# EasyEDA schematic scheme.json
TITLE: 220Vac 3-INPUT OR GATE; REV: A; Sheet: 1/1; Drawn By: Perovic Milo
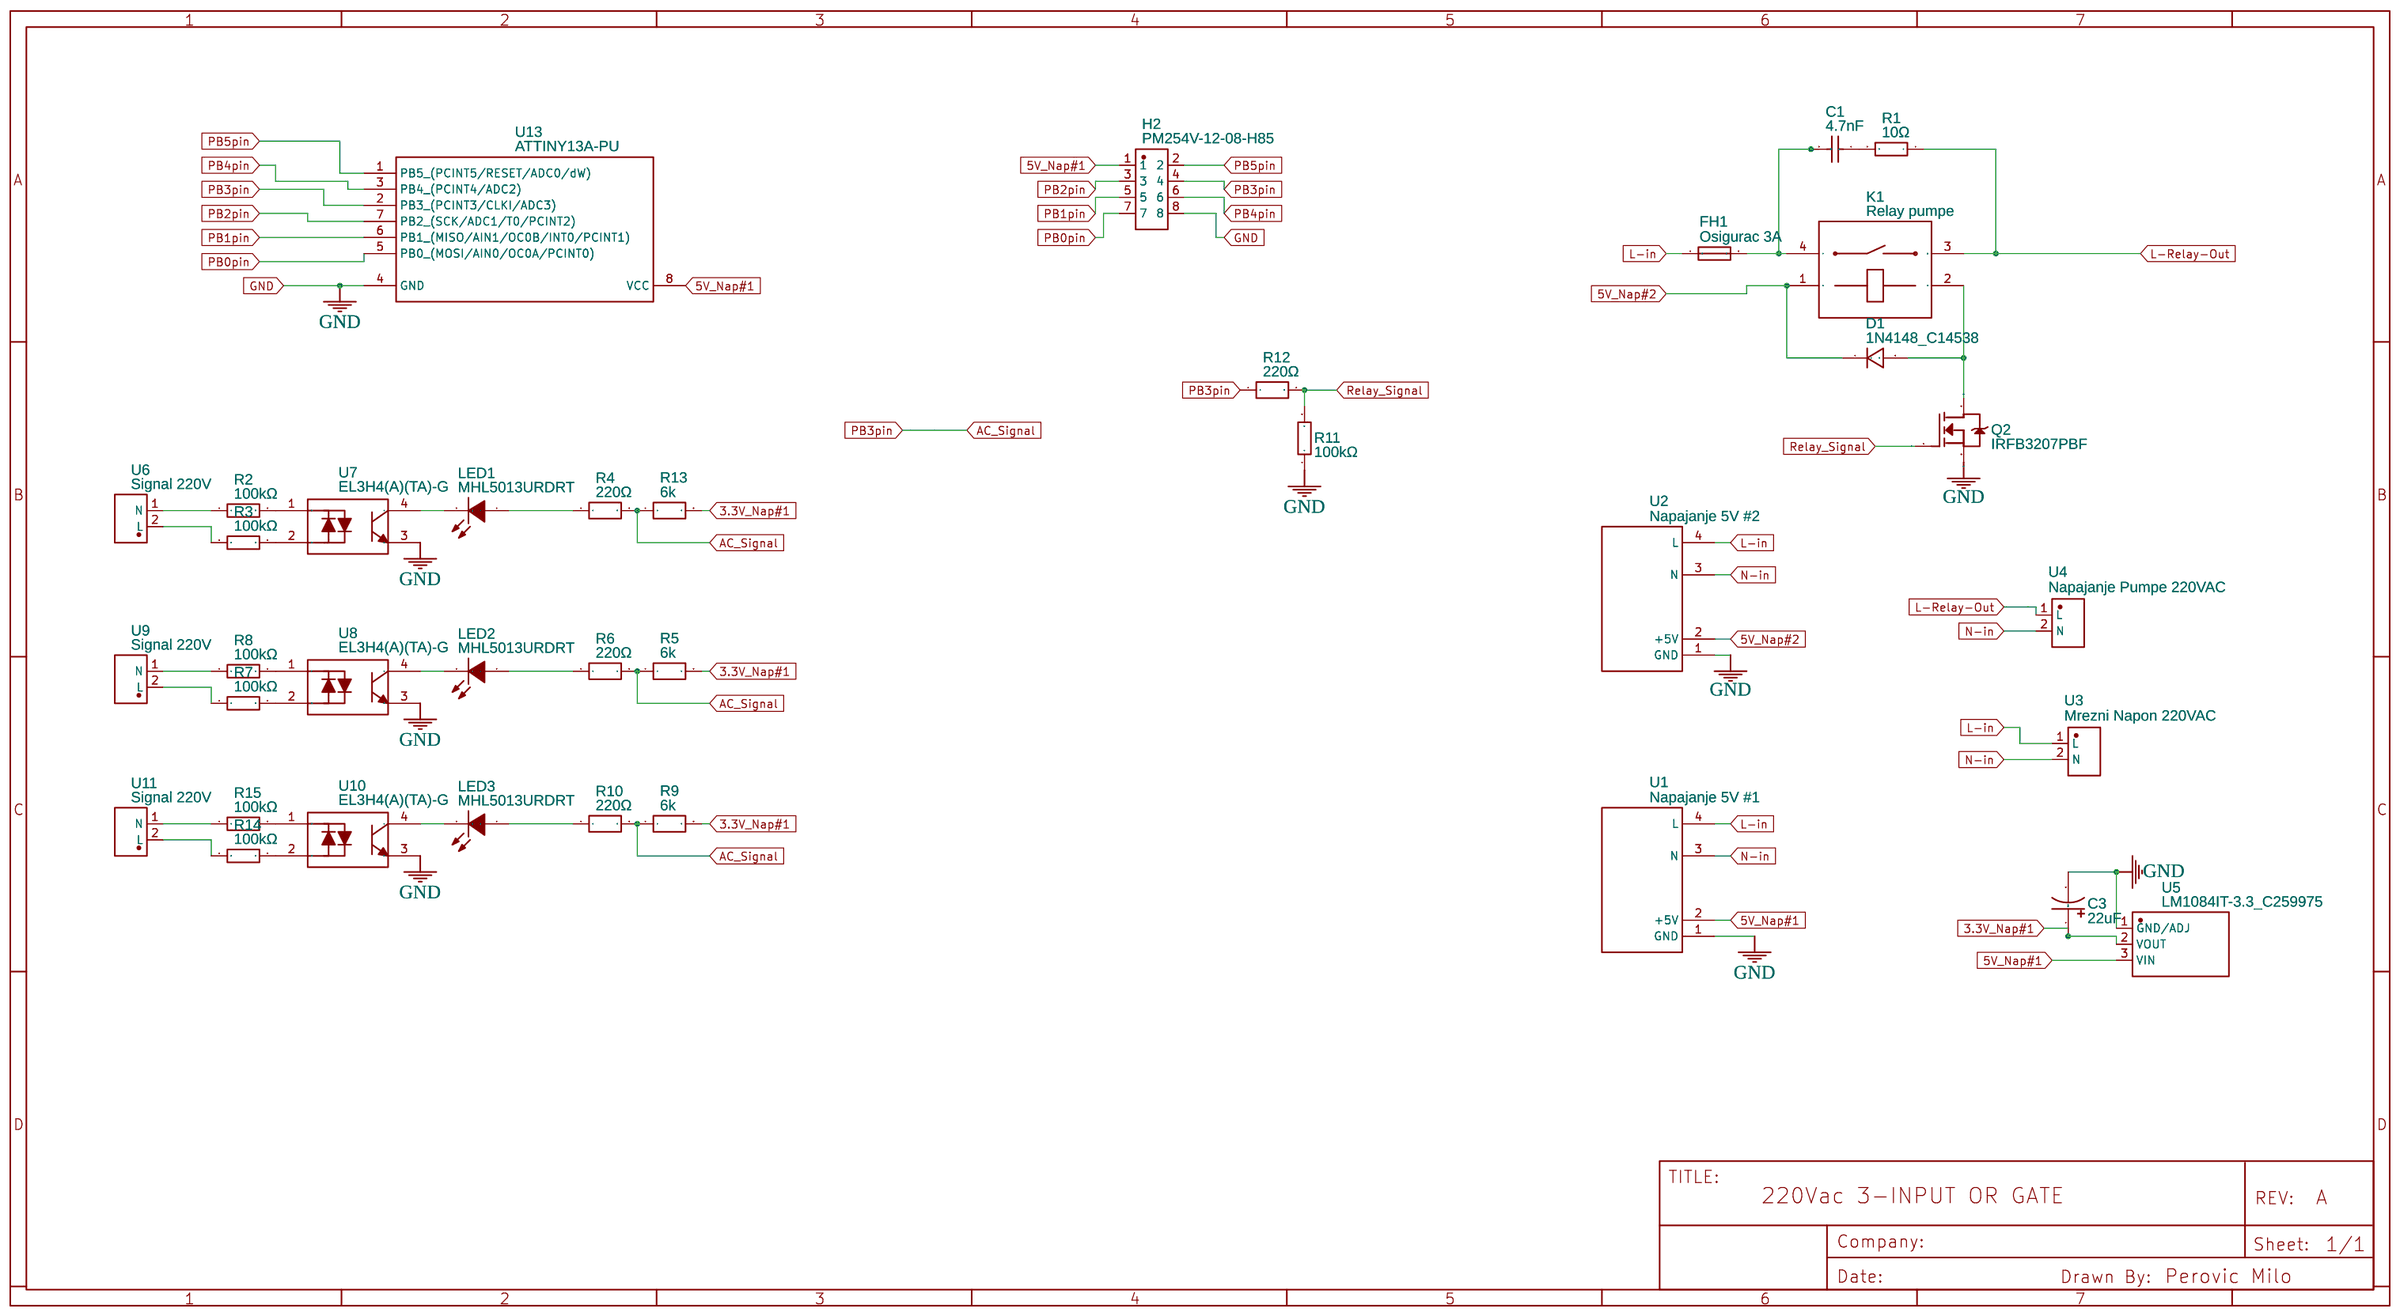
[diagram p0: schematic sheet]

## Parts
C1  4.7nF  [CAP-TH_L13.0-W4.0-P10.00-D1.0]
C3  22uF  [CAP-TH_BD8.0-P3.50-D0.6-FD_1]
D1  1N4148_C14538  [DO-35_BD2.0-L4.2-P8.20-D0.5-RD]
FH1  Osigurac 3A  [FUSE-TH_L24.8-W9.8-P22.60]
H2  PM254V-12-08-H85  [HDR-TH_8P-P2.54-V-F-R2-C4-S2.54]
K1  Relay pumpe  [RELAY-TH_HF32F-X-HXXXX-XXX]
LED1  MHL5013URDRT  [LED-TH_BD5.8-P2.54-FD]
LED2  MHL5013URDRT  [LED-TH_BD5.8-P2.54-FD]
LED3  MHL5013URDRT  [LED-TH_BD5.8-P2.54-FD]
Q2  IRFB3207PBF  [TO-220-3_L10.0-W4.5-P2.54-T]
R1  10Ω  [R2512]
R2  100kΩ  [R2010]
R3  100kΩ  [R2010]
R4  220Ω  [R0402]
R5  6k  [R0603]
R6  220Ω  [R0402]
R7  100kΩ  [R2010]
R8  100kΩ  [R2010]
R9  6k  [R0603]
R10  220Ω  [R0402]
R11  100kΩ  [R2010]
R12  220Ω  [R0402]
R13  6k  [R0603]
R14  100kΩ  [R2010]
R15  100kΩ  [R2010]
U1  Napajanje 5V #1  [WX-DC12003]
U2  Napajanje 5V #2  [WX-DC12003]
U3  Mrezni Napon 220VAC  [CONN-TH_P5.00_KF301-5.0-2P]
U4  Napajanje Pumpe 220VAC  [CONN-TH_P5.00_KF301-5.0-2P]
U5  LM1084IT-3.3_C259975  [TO-220F-3_L10.2-W4.7-P2.54-L]
U6  Signal 220V  [CONN-TH_P5.00_KF301-5.0-2P]
U7  EL3H4(A)(TA)-G  [SOP-4_L4.4-W2.8-P1.27-LS7.0-TL]
U8  EL3H4(A)(TA)-G  [SOP-4_L4.4-W2.8-P1.27-LS7.0-TL]
U9  Signal 220V  [CONN-TH_P5.00_KF301-5.0-2P]
U10  EL3H4(A)(TA)-G  [SOP-4_L4.4-W2.8-P1.27-LS7.0-TL]
U11  Signal 220V  [CONN-TH_P5.00_KF301-5.0-2P]
U13  ATTINY13A-PU  [DIP-8_L9.3-W6.4-P2.54-LS7.6-BL-1]

## Library data of the parts
C1 = B32021A3472K000: Supplier: LCSC; Manufacturer: TDK; Contributor: LCSC; Supplier Part: C125377; JLCPCB Part Class: Extended Part
C3 = TM2262AME122RB: Supplier: LCSC; Supplier Part: C399122; Manufacturer: Xunda(讯达); Contributor: LCSC; JLCPCB Part Class: Extended Part
D1 = 1N4148_C14538: Supplier: LCSC; Supplier Part: C14538; Manufacturer: ST(先科); Manufacturer Part: 1N4148; Contributor: LCSC; JLCPCB Part Class: Extended Part
FH1 = FH1-200CK-B: Supplier: LCSC; Supplier Part: C268205; Manufacturer: HONGJU(宏聚); Contributor: LCSC; JLCPCB Part Class: Extended Part
H2 = PM254V-12-08-H85: Supplier: LCSC; Supplier Part: C541854; Manufacturer: XFCN(兴飞); Contributor: LCSC; JLCPCB Part Class: Extended Part
K1 = HF32F/005-HS: Supplier: LCSC; Supplier Part: C192283; Manufacturer: HF(宏发); Contributor: LCSC; JLCPCB Part Class: Extended Part
LED1-LED3 = MHL5013URDRT: Supplier: LCSC; Supplier Part: C417347; Manufacturer: MEIHUA(美华); Contributor: LCSC; JLCPCB Part Class: Extended Part
Q2 = IRFB3207PBF: Supplier: LCSC; Manufacturer: Infineon(英飞凌); Supplier Part: C2578; JLCPCB Part Class: Extended Part
R1 = 25121WJ0100T4E: Supplier: LCSC; Manufacturer: UNI-ROYAL(厚声); Supplier Part: C16861; Resistance (Ohms): 10; JLCPCB Part Class: Extended Part
R2 R3 R7 R8 R11 R14 R15 = CR2010J100KE04: Supplier: LCSC; Manufacturer: EVER OHMS(天二科技); Manufacturer Part: CR2010J100KE04Z; Supplier Part: C146846; Resistance (Ohms): 100K; JLCPCB Part Class: Extended Part
R4 R6 R10 R12 = CR0402J220RQ10Z: Supplier: LCSC; Supplier Part: C881043; Manufacturer: EVER OHMS(天二科技); Contributor: LCSC; JLCPCB Part Class: Extended Part
R5 R9 R13 = R_0603_EU: Contributor: LCEDA_Lib
U1 U2 = WX-DC12003: Contributor: stopka
U3 U4 U6 U9 U11 = KF301-5.0-2P: Supplier: LCSC; Supplier Part: C474881; Manufacturer: KEFA(科发); Contributor: LCSC; JLCPCB Part Class: Extended Part
U5 = LM1084IT-3.3_C259975: Supplier: LCSC; Supplier Part: C259975; Manufacturer: HGSEMI(华冠); Manufacturer Part: LM1084IT-3.3; Contributor: LCSC; JLCPCB Part Class: Extended Part
U7 U8 U10 = EL3H4(A)(TA)-G: Supplier: LCSC; Manufacturer: EVERLIGHT(亿光); Contributor: LCSC; Supplier Part: C142288; JLCPCB Part Class: Extended Part
U13 = ATTINY13A-PU: Supplier: LCSC; Supplier Part: C94341; Manufacturer: MICROCHIP(美国微芯); Contributor: LCSC; JLCPCB Part Class: Extended Part

## Nets
3.3V_Nap#1: C3.1 R5.2 R9.2 R13.2 U5.2(VOUT)
5V_Nap#1: H2.1 U1.2(+5V) U5.3(VIN) U13.8(VCC)
5V_Nap#2: D1.1 K1.1 U2.2(+5V)
GND: C3.2 H2.8 Q2.3(S) R11.1 U1.1(GND) U2.1(GND) U5.1(GND/ADJ) U7.3 U8.3 U10.3 U13.4(GND)
AC_Signal: H2.4 R4.2 R5.1 R6.2 R9.1 R10.2 R12.1 R13.1 U13.2(PB3 (PCINT3/CLKI/ADC3))
L-in: FH1.1 U1.4(L) U2.4(L) U3.1(L)
L-Relay-Out: K1.3 R1.1 U4.1(L)
N-in: U1.3(N) U2.3(N) U3.2(N) U4.2(N)
PB0pin: H2.7 U13.5(PB0 (MOSI/AIN0/OC0A/PCINT0))
PB1pin: H2.5 U13.6(PB1 (MISO/AIN1/OC0B/INT0/PCINT1))
PB2pin: H2.3 U13.7(PB2 (SCK/ADC1/T0/PCINT2))
PB4pin: H2.6 U13.3(PB4 (PCINT4/ADC2))
PB5pin: H2.2 U13.1(PB5 (PCINT5/RESET/ADC0/dW))
Relay_Signal: Q2.1(G) R11.2 R12.2
Net-(C1-1): C1.1 R1.2
Net-(C1-2): C1.2 FH1.2 K1.4
Net-(D1-2): D1.2 K1.2 Q2.2(D)
Net-(LED1-1): LED1.1(A) R4.1
Net-(LED1-2): LED1.2(C) U7.4
Net-(LED2-1): LED2.1(A) R6.1
Net-(LED2-2): LED2.2(C) U8.4
Net-(LED3-1): LED3.1(A) R10.1
Net-(LED3-2): LED3.2(C) U10.4
Net-(R2-1): R2.1 U6.1(N)
Net-(R2-2): R2.2 U7.1
Net-(R3-1): R3.1 U6.2(L)
Net-(R3-2): R3.2 U7.2
Net-(R7-1): R7.1 U9.2(L)
Net-(R7-2): R7.2 U8.2
Net-(R8-1): R8.1 U9.1(N)
Net-(R8-2): R8.2 U8.1
Net-(R14-1): R14.1 U11.2(L)
Net-(R14-2): R14.2 U10.2
Net-(R15-1): R15.1 U11.1(N)
Net-(R15-2): R15.2 U10.1
